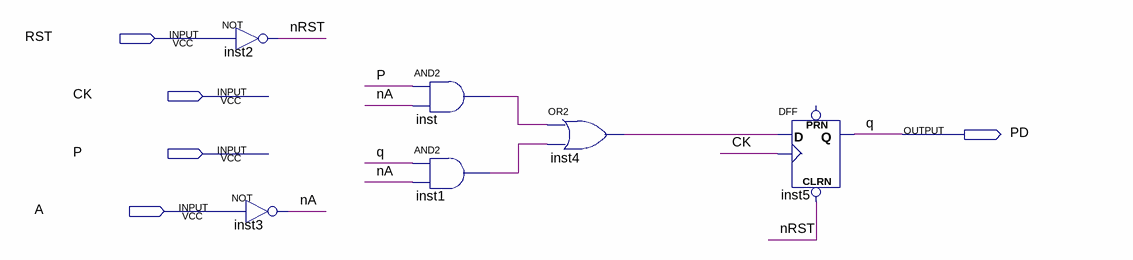
[diagram p0: schematic sheet]
// Quartus schematic Pisos_demanats_1_bit.bdf as structural Verilog: 6 symbols, 5 pins
module Pisos_demanats_1_bit (
  input  RST,
  input  CK,
  input  P,
  input  A,
  output PD
);

  wire inst1_out, inst4_out, inst_out, nA, nRST;

  not inst2 (nRST, RST);
  not inst3 (nA, A);
  and inst (inst_out, P, nA);
  and inst1 (inst1_out, PD, nA);
  or inst4 (inst4_out, inst_out, inst1_out);
  DFF inst5 (.CLRN(nRST), .CLK(CK), .D(inst4_out), .Q(PD));  // open: PRN

  // Other names for the same wires on the sheet: q = PD
endmodule
